# EAGLE schematic partB (EAGLE 7.4.0)
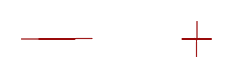
[diagram p0: schematic, sheet 1]

## Parts
C1  100n  C-EU025-025X050  [C_RADIAL]
R1  1k  R-EU_0207/10  [R_AXIAL]
Unconnected: C1.1 C1.2 R1.1 R1.2

## Library data of the parts
C1 = rcl:C-EU
R1 = rcl:R-EU_